# EAGLE design esp8266-dev2 (EAGLE 7.6.0)
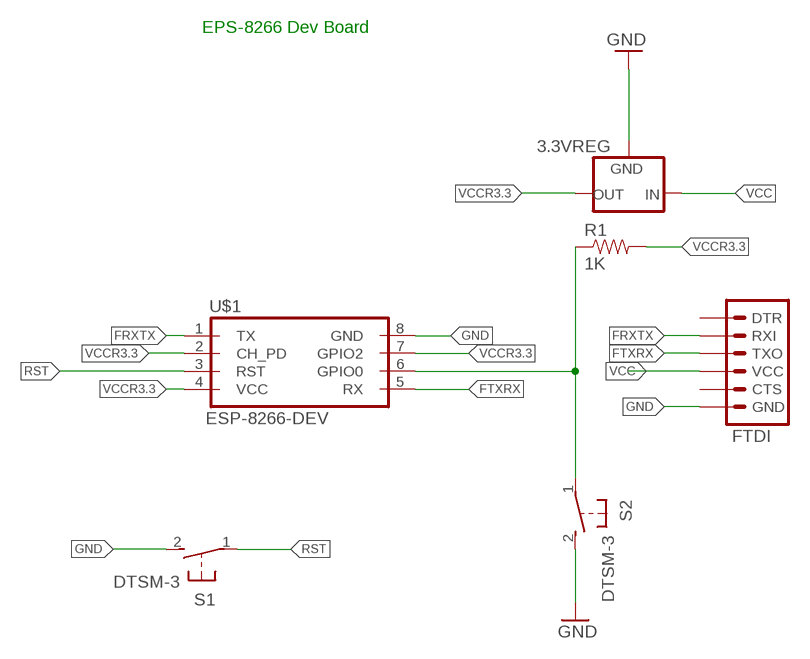
[diagram p0: schematic, sheet 1]

## Parts
3.3VREG  LM1117V  [78XXS]
FTDI  ARDUINO_SERIAL_PROGRAMPTH  [1X06]
R1  1K  1KOHM-1/4W-1%(PTH)HORIZ-KIT  [AXIAL-0.3EZ]
S1  DTSM-3  [DTSM-3]
S2  DTSM-3  [DTSM-3]
U$1  ESP-8266-DEV  [2X4]

## Nets
FRXTX: FTDI.2(RXI) U$1.1(TX)
FTXRX: FTDI.3(TXO) U$1.5(RX)
GND: 3.3VREG.GND FTDI.6(GND) S1.2 S2.2 U$1.8(GND)
N$1: R1.P$1 S2.1 U$1.6(GPIO0)
RST: S1.1 U$1.3(RST)
VCC: 3.3VREG.IN FTDI.4(VCC)
VCCR3.3: 3.3VREG.OUT R1.P$2 U$1.2(CH_PD) U$1.4(VCC) U$1.7(GPIO2)
Unconnected: FTDI.1(DTR) FTDI.5(CTS)

## Notes on the sheet
- EPS-8266 Dev Board

## Library data of the parts
3.3VREG = v-reg-3:LM1117; OC_NEWARK: unknown
FTDI = SparkFun-Connectors:ARDUINO_SERIAL_PROGRAM: FTDI connector footprints; OC_NEWARK: unknown
R1 = SparkFun-Resistors:1KOHM-1/4W-1%(PTH): RES-12182; MF: FARNELL; MPN: MCF 0.25W 1K; OC_NEWARK: 38K0327; PROD_ID: RES-12182
S1 S2 = switch-tact:DTSM-3; MPN: DTSM-32S-B; OC_NEWARK: 96K8956
U$1 = cmdc0de-esp8266:ESP-8266-DEV

## Net classes
0 default: width 0.305 mm, drill 0.508 mm, clearance 0.254 mm

## Board
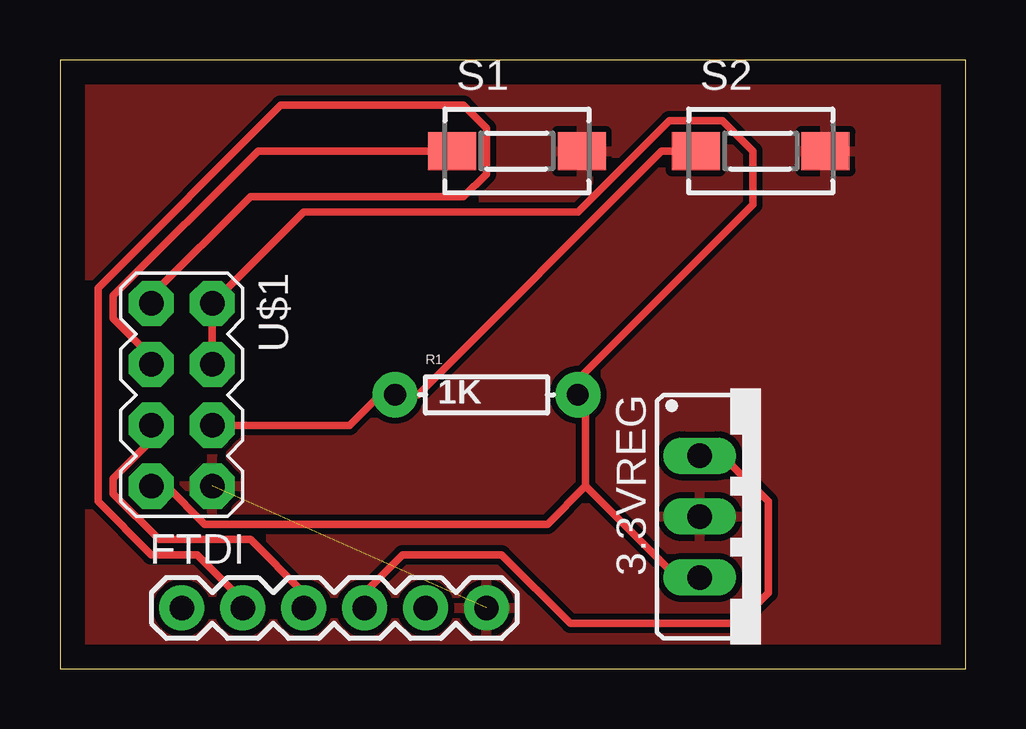
[diagram p1: board, top side]

Size 37.77 x 25.39 mm. Coordinates in mm from the lower left corner, seen from the top.
Outline: 0,0 37.77,0 37.77,25.39 0,25.39 0,0
Copper layers (1*16): Top 0.035mm / dielectric 1.5mm / Bottom 0.035mm
Design rules "default": minimum track width 10mil, minimum drill 24mil, track to track 8mil, track to pad 8mil, pad to pad 8mil, via to via 8mil, smd to smd 8mil, copper to edge 40mil, drill to drill 8mil, minimum pad ring 10mil, minimum via ring 8mil, stop-mask expansion 4mil, vias tented up to drill 0mil, thermal gap 10mil

### Footprints (pad centres in the part's own frame; a part is rotated, then mirrored left to right if it is on the bottom)
78XXS = drill 1.016 long: GND 0,-2.54; IN -2.54,-2.54; OUT 2.54,-2.54
1X06 = drill 1.016 pad 1.88: 1 0,0; 2 2.54,0; 3 5.08,0; 4 7.62,0; 5 10.16,0; 6 12.7,0
AXIAL-0.3EZ = drill 0.9 pad 1.88: P$1 -3.81,0; P$2 3.81,0
DTSM-3 = smd 2 x 1.6: 1 -2.7,0; 2 2.7,0
2X4 = drill 1.016 pad 1.88 octagon: 1 -3.81,-1.27; 2 -3.81,1.27; 3 -1.27,-1.27; 4 -1.27,1.27; 5 1.27,-1.27; 6 1.27,1.27; 7 3.81,-1.27; 8 3.81,1.27

### Placement (x,y rotation side)
3.3VREG  29.21,6.35 270 top
FTDI  5.08,2.54 0 top
R1  17.78,11.43 0 top
S1  19.05,21.59 0 top
S2  29.21,21.59 0 top
U$1  5.08,11.43 270 top

### Tracks (layer width: path | path; a pad name or v marks a point on that pad's centre or on a via)
FRXTX
  Top 0.305: FTDI.2 7.62,2.86 5.71,4.76 3.81,4.76 1.59,6.99 1.59,15.88 9.21,23.5 16.83,23.5 17.78,22.54 17.78,20.64 16.83,19.68 7.94,19.68 3.81,15.56 U$1.1
FTXRX
  Top 0.305: U$1.5 3.81,9.53 2.22,7.94 2.22,7.3 4.13,5.4 7.94,5.4 10.16,3.17 FTDI.3
GND  (1 unrouted)
  pour Top: -1.27,27.94 -1.27,-2.54 40.64,-2.54 40.64,27.94
N$1
  Top 0.305: S2.1 25.08,21.59 14.92,11.43 R1.P$1 13.34,11.43 12.06,10.16 U$1.6
RST
  Top 0.305: S1.1 8.26,21.59 2.22,15.56 2.22,14.61 3.81,13.02 U$1.3
VCC
  Top 0.305: 3.3VREG.IN 27.62,8.89 29.53,6.99 29.53,3.17 28.26,1.91 21.27,1.91 18.41,4.76 14.29,4.76 12.7,3.17 FTDI.4
VCCR3.3
  Top 0.305: U$1.4 U$1.2 10.16,19.05 21.59,19.05 25.4,22.86 27.62,22.86 28.89,21.59 28.89,19.37 21.59,12.06 R1.P$2 21.91,11.11 21.91,7.62 | 3.3VREG.OUT 25.72,3.81 21.91,7.62 | U$1.7 4.45,7.62 6.03,6.03 20.32,6.03 21.91,7.62